# EAGLE design Wheel_Encoder_Adapter_3 (EAGLE 5.09)
BOM: EXCLUDE; PARTNO: CRCW08051K00FKEA
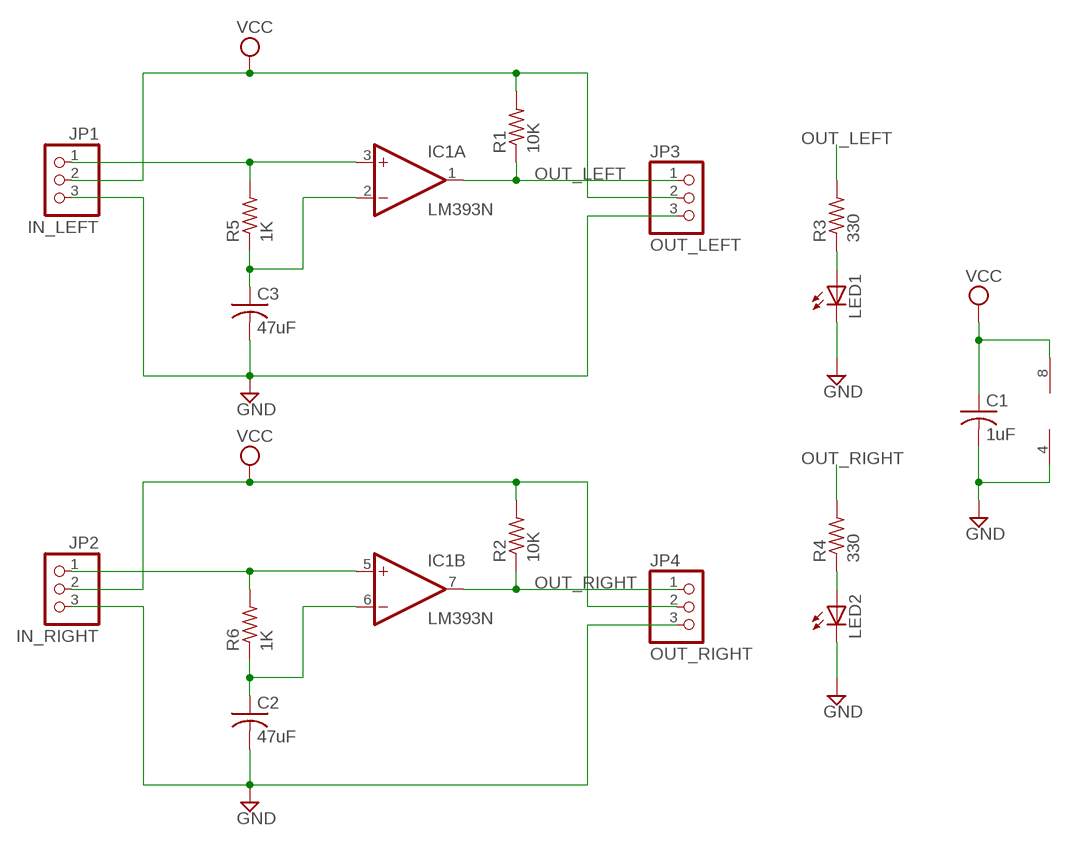
[diagram p0: schematic, sheet 1]

## Parts
C1  1uF  C-USC0805  [C0805]
C2  47uF  C-USC1206  [C1206]
C3  47uF  C-USC1206  [C1206]
IC1  LM393N  [DIL08]
JP1  IN_LEFT  PINHD-1X03_2.54-S  [1X03-S]
JP2  IN_RIGHT  PINHD-1X03_2.54-S  [1X03-S]
JP3  OUT_LEFT  PINHD-1X03_2.54-S  [1X03-S]
JP4  OUT_RIGHT  PINHD-1X03_2.54-S  [1X03-S]
LED1  LED3MM  [LED3MM]
LED2  LED3MM  [LED3MM]
R1  10K  R-US_M0805  [M0805]
R2  10K  R-US_M0805  [M0805]
R3  330  R-US_M0805  [M0805]
R4  330  R-US_M0805  [M0805]
R5  1K  R-US_M0805  [M0805]
R6  1K  R-US_M0805  [M0805]

## Nets
GND: C1.2 C2.2 C3.2 IC1.4(P:V-) JP1.3 JP2.3 JP3.3 JP4.3 LED1.K(C) LED2.K(C)
N$2: C3.1 IC1.2(A:-IN) R5.1
N$3: IC1.3(A:+IN) JP1.1 R5.2
N$4: IC1.5(B:+IN) JP2.1 R6.2
N$5: LED2.A R4.1
N$7: C2.1 IC1.6(B:-IN) R6.1
N$8: LED1.A R3.1
OUT_LEFT: IC1.1(A:OUT) JP3.1 R1.1 R3.2
OUT_RIGHT: IC1.7(B:OUT) JP4.1 R2.1 R4.2
VCC: C1.1 IC1.8(P:V+) JP1.2 JP2.2 JP3.2 JP4.2 R1.2 R2.2

## Library data of the parts
C1-C3 = rcl:C-US: CAPACITOR, American symbol
IC1 = linear:LM393: COMPARATOR
JP1-JP4 = pinhead-2:PINHD-1X03: PIN HEADER
LED1 LED2 = led:LED: LED OSRAM: - CHIPLED LG R971, LG N971, LY N971, LG Q971, LY Q971, LO R971, LY R971 LH N974, LH R974 LS Q976, LO Q976, LY Q976 LO Q996 - Hyper CHIPLED LW Q18S LB Q993, LB Q99A, LB R99A - SideLED LS A670, LO A670, LY A670, LG A670, LP A670 LB A673, LV A673, LT A673, LW A673 LH A674 LY A675 LS A676, LA A676, LO A676, LY A676, LW A676 LS A679, LY A679, LG A679 - Hyper Micro SIDELED® LS Y876, LA Y876, LO Y876, LY Y876 LT Y87S - SmartLED LW L88C, LW L88S LB L89C, LB L89S, LG L890 LS L89K, LO L89K, LY L89K LS L896, LA L896, LO L896, LY L896 - TOPLED LS T670, LO T670, LY T670, LG T670, LP T670 LSG T670, LSP T670, LSY T670, LOP T670, LYG T670 LG T671, LOG T671, LSG T671 LB T673, LV T673, LT T673, LW T673 LH T674 LS T676, LA T676, LO T676, LY T676, LB T676, LH T676, LSB T676, LW T676 LB T67C, LV T67C, LT T67C, LS T67K, LO T67K, LY T67K, LW E67C LS E67B, LA E67B, LO E67B, LY E67B, LB E67C, LV E67C, LT E67C LW T67C LS T679, LY T679, LG T679 LS T770, LO T770, LY T770, LG T770, LP T770 LB T773, LV T773, LT T773, LW T773 LH T774 LS E675, LA E675, LY E675, LS T675 LS T776, LA T776, LO T776, LY T776, LB T776 LHGB T686 LT T68C, LB T68C - Hyper Mini TOPLED® LB M676 - Mini TOPLED Santana® LG M470 LS M47K, LO M47K, LY M47K Source: http://www.osram.convergy.de LUXEON: - LUMILED® LXK2-PW12-R00, LXK2-PW12-S00, LXK2-PW14-U00, LXK2-PW14-V00 LXK2-PM12-R00, LXK2-PM12-S00, LXK2-PM14-U00 LXK2-PE12-Q00, LXK2-PE12-R00, LXK2-PE12-S00, LXK2-PE14-T00, LXK2-PE14-U00 LXK2-PB12-K00, LXK2-PB12-L00, LXK2-PB12-M00, LXK2-PB14-N00, LXK2-PB14-P00, LXK2-PB14-Q00 LXK2-PR12-L00, LXK2-PR12-M00, LXK2-PR14-Q00, LXK2-PR14-R00 LXK2-PD12-Q00, LXK2-PD12-R00, LXK2-PD12-S00 LXK2-PH12-R00, LXK2-PH12-S00 LXK2-PL12-P00, LXK2-PL12-Q00, LXK2-PL12-R00 Source: www.luxeon.com KINGBRIGHT: KA-3528ASYC Source: www.kingbright.com
R1-R6 = resistor:R-US_: RESISTOR, American symbol

## Board
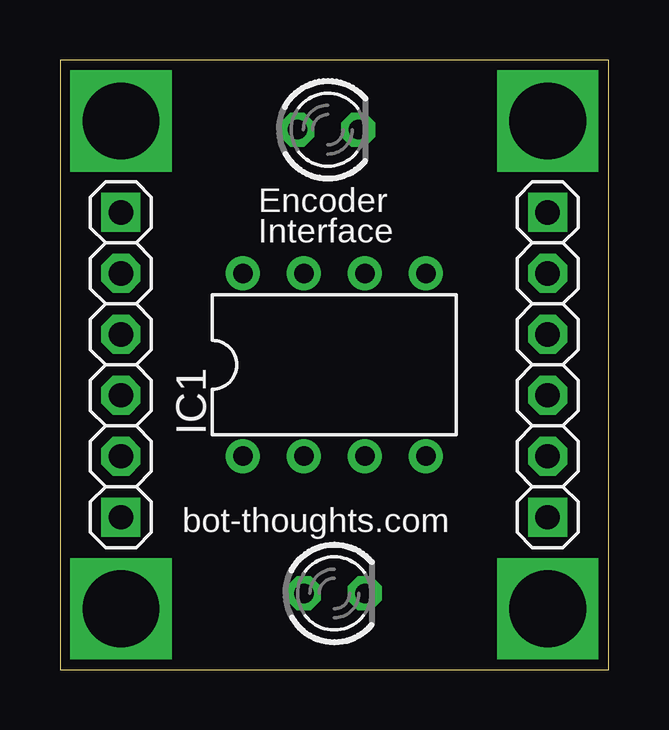
[diagram p1: board, top side]
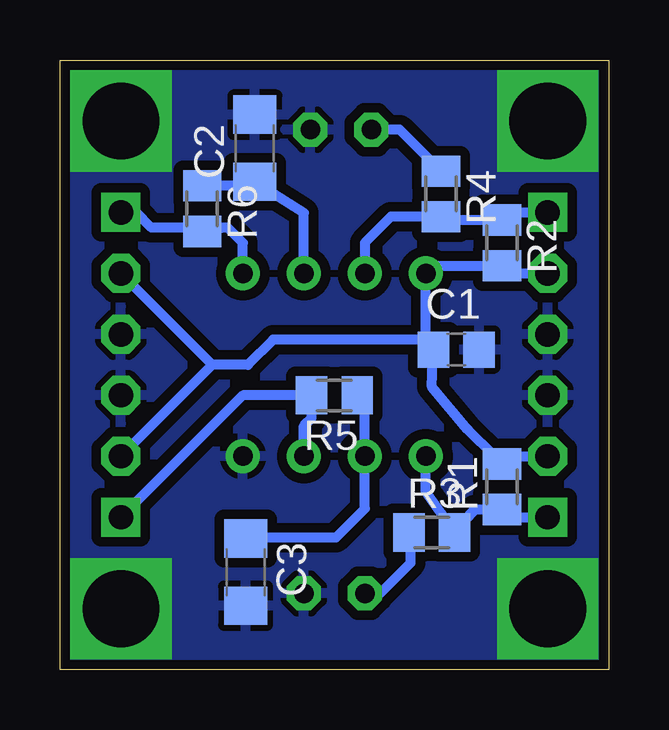
[diagram p2: board, bottom side, seen from below]

Size 22.86 x 25.4 mm. Coordinates in mm from the lower left corner, seen from the top.
Outline: 0,0 22.86,0 22.86,25.4 0,25.4 0,0
Copper layers (1*16): Top 0.035mm / dielectric 1.5mm / Bottom 0.035mm
Design rules "SparkFun": minimum track width 8mil, minimum drill 20mil, track to track 8mil, track to pad 8mil, pad to pad 8mil, via to via 8mil, smd to smd 8mil, copper to edge 10mil, drill to drill 8mil, minimum pad ring 12mil, minimum via ring 10mil, stop-mask expansion 4mil, vias tented up to drill 25mil, thermal gap 10mil

### Footprints (pad centres in the part's own frame; a part is rotated, then mirrored left to right if it is on the bottom)
C0805 = smd 1.3 x 1.5: 1 -0.95,0; 2 0.95,0
C1206 = smd 1.6 x 1.8: 1 -1.4,0; 2 1.4,0
DIL08 = drill 0.813 pad 1.27 round: 1 -3.81,-3.81; 2 -1.27,-3.81; 3 1.27,-3.81; 4 3.81,-3.81; 5 3.81,3.81; 6 1.27,3.81; 7 -1.27,3.81; 8 -3.81,3.81
1X03-S = drill 1.016 square: 1 -2.54,0 | drill 1.016 octagon: 2 0,0; 3 2.54,0
LED3MM = drill 0.813 octagon: A -1.27,0; K 1.27,0
M0805 = smd 1.3 x 1.6: 1 -0.95,0; 2 0.95,0

### Placement (x,y rotation side)
C1  6.35,13.34 0 bottom
C2  14.74,21.73 90 bottom
C3  15.12,4.06 270 bottom
IC1  11.43,12.7 0 top
JP1  20.32,8.89 90 top
JP2  20.32,16.51 270 top
JP3  2.54,8.89 90 top
JP4  2.54,16.51 270 top
LED1  11.43,3.17 0 top
LED2  11.16,22.5 0 top
R1  4.45,7.62 90 bottom
R2  4.45,17.78 270 bottom
R3  7.37,5.71 0 bottom
R4  6.99,19.82 270 bottom
R5  11.43,11.43 180 bottom
R6  16.93,19.2 270 bottom

### Tracks (layer width: path | path; a pad name or v marks a point on that pad's centre or on a via)
GND  (via drill 3.2)
  other vias: 2.54,2.54 2.54,22.86 20.32,22.86 20.32,2.54
  pour Bottom (isolate 0.406, rank 6): 0,25.4 22.86,25.4 22.86,0 0,0
N$2
  Bottom 0.406: C3.1 15.24,5.71 15.03,5.5 11.37,5.5 10.16,6.71 IC1.2 10.16,11.74 R5.1
N$3
  Bottom 0.406: JP1.1 15.24,11.43 R5.2 12.38,10.48 12.7,10.16 IC1.3
N$4
  Bottom 0.406: JP2.1 19.68,19.05 19.05,18.41 16,18.41 | 16,18.41 R6.2 | 16,18.41 15.88,18.41 15.24,17.78 IC1.5
N$5
  Bottom 0.406: LED2.A 8.71,22.5 R4.1
N$7
  Bottom 0.406: R6.1 15.09,20.17 C2.1 12.7,19.04 IC1.6
N$8
  Bottom 0.406: LED1.A 9.53,3.17 8.26,4.45 8.26,5.65 R3.1
OUT_LEFT
  Bottom 0.406: JP3.1 4.12,6.35 R1.1 5.59,6.67 R3.2 7.62,7.42 IC1.1
OUT_RIGHT
  Bottom 0.406: JP4.1 4.12,19.05 R2.1 6.34,18.73 R4.2 9.07,18.87 10.16,17.78 IC1.7
VCC
  Bottom 0.406: JP4.2 4.12,16.51 R2.2 7.3,16.83 IC1.8 7.62,13.85 7.72,13.75 | 16.51,12.7 JP1.2 | 16.51,12.7 JP2.2 | 4.12,8.89 JP3.2 | R1.2 4.12,8.89 | 16.51,12.7 15.03,12.7 13.98,13.75 7.72,13.75 | 7.72,13.75 C1.1 7.37,11.79 5.87,10 4.75,8.89 4.12,8.89

### Text on the board
tNames: Encoder | Interface | bot-thoughts.com
tDocu: OUTPUT | INPUT